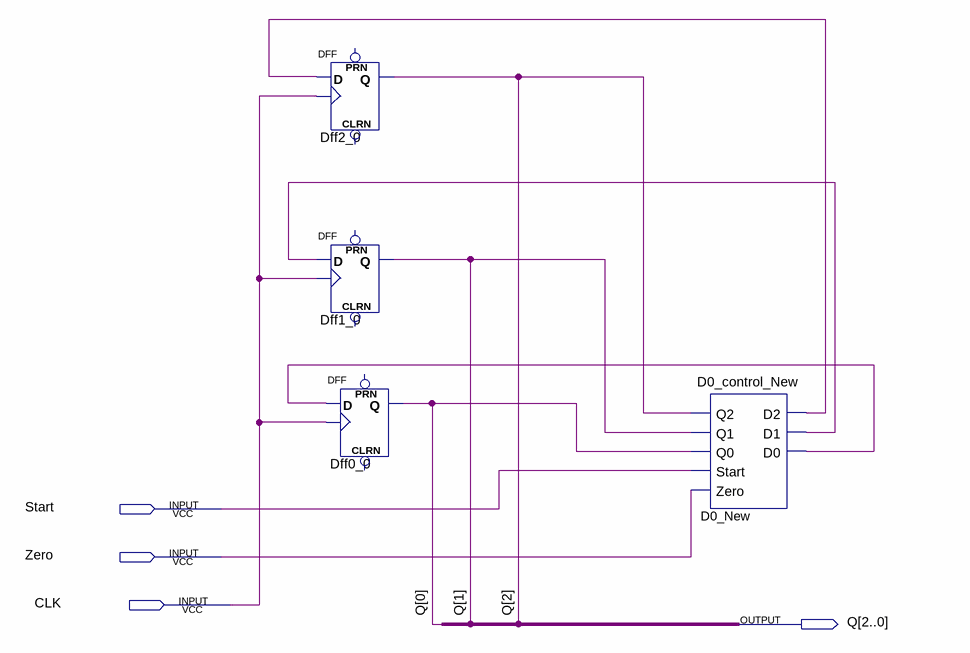
[diagram p0: schematic sheet]
// Quartus schematic Start_Zero_New.bdf as structural Verilog: 4 symbols, 4 pins
module Start_Zero_New (
  input  Start,
  input  Zero,
  input  CLK,
  output [2:0] Q
);

  wire D0_New_d0, D0_New_d1, D0_New_d2;

  DFF Dff2_0 (.CLK(CLK), .D(D0_New_d2), .Q(Q[2]));  // open: CLRN, PRN
  DFF Dff1_0 (.CLK(CLK), .D(D0_New_d1), .Q(Q[1]));  // open: CLRN, PRN
  DFF Dff0_0 (.CLK(CLK), .D(D0_New_d0), .Q(Q[0]));  // open: CLRN, PRN
  D0_control_New D0_New (
    .Q2(Q[2]), .Q1(Q[1]), .Q0(Q[0]), .Start(Start), .Zero(Zero), .D2(D0_New_d2), .D1(D0_New_d1),
    .D0(D0_New_d0));
endmodule
